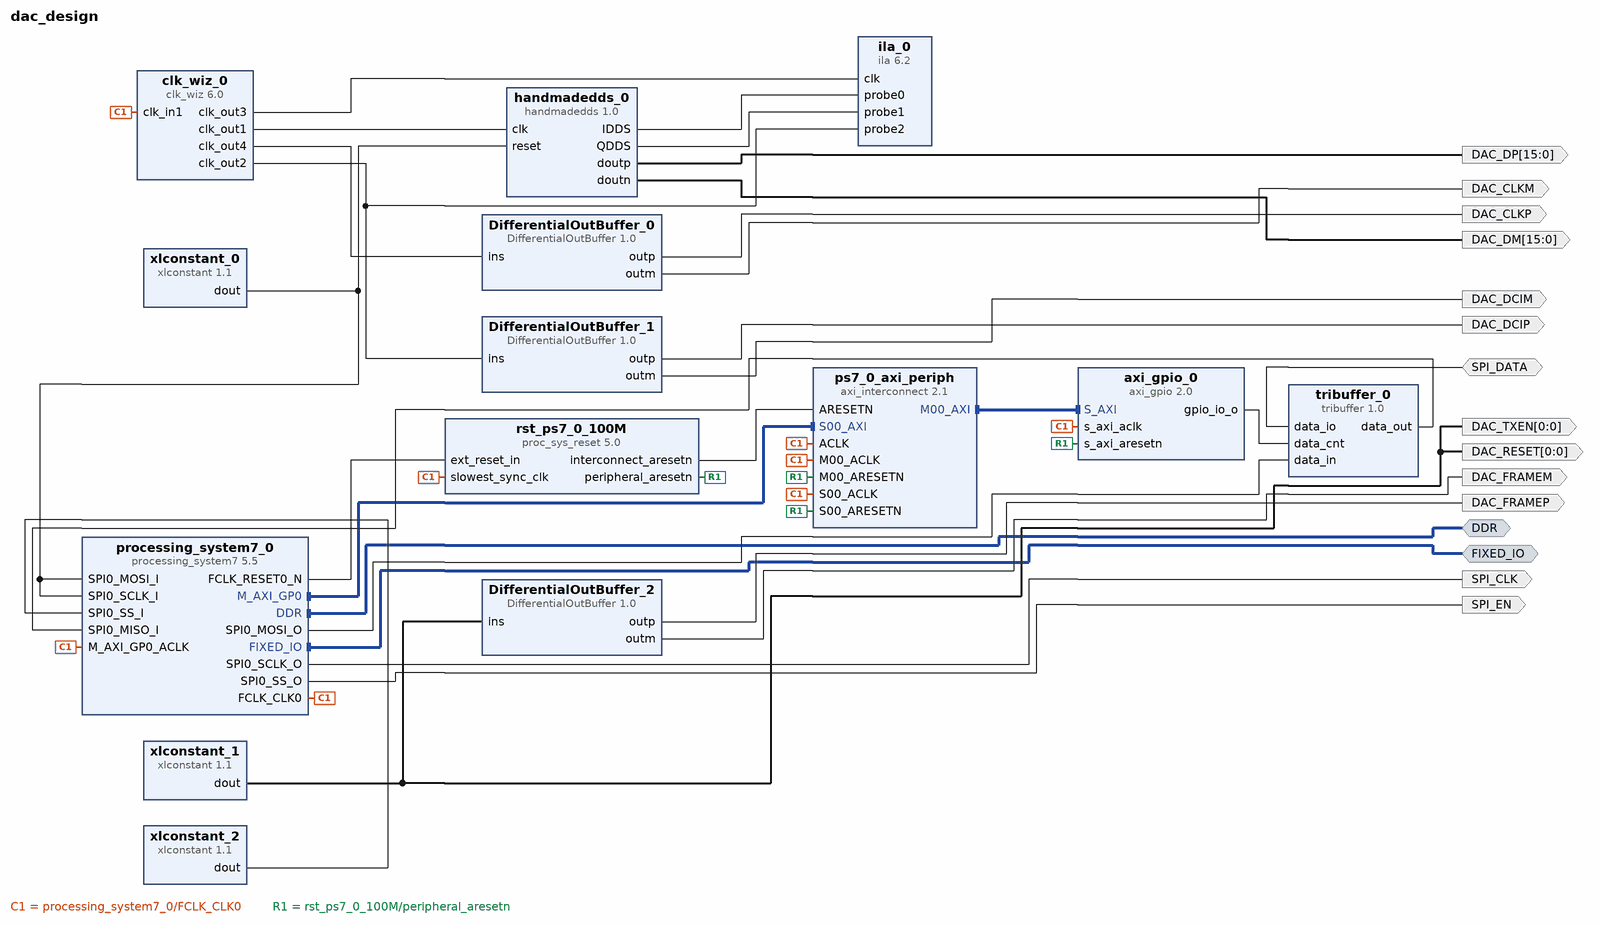
[diagram p0: block diagram of the top level]
# Vivado block design dac_design, xc7z020clg484-1, Vivado 2018.1
create_bd_design dac_design

create_bd_intf_port -mode Master -vlnv xilinx.com:interface:ddrx_rtl:1.0 DDR
create_bd_intf_port -mode Master -vlnv xilinx.com:display_processing_system7:fixedio_rtl:1.0 FIXED_IO
create_bd_port -dir O -type clk DAC_CLKP
create_bd_port -dir O -type clk DAC_CLKM
create_bd_port -dir O -type clk DAC_DCIP
create_bd_port -dir O -type clk DAC_DCIM
create_bd_port -dir O -from 15 -to 0 DAC_DP
create_bd_port -dir O -from 15 -to 0 DAC_DM
create_bd_port -dir O DAC_FRAMEP
create_bd_port -dir O DAC_FRAMEM
create_bd_port -dir O -type clk SPI_CLK
create_bd_port -dir O SPI_EN
create_bd_port -dir IO SPI_DATA
create_bd_port -dir O -from 0 -to 0 DAC_RESET
create_bd_port -dir O -from 0 -to 0 DAC_TXEN

create_bd_cell -type ip -vlnv xilinx.com:ip:processing_system7:5.5 processing_system7_0
set_property -dict [list \
  CONFIG.PCW_UIPARAM_DDR_FREQ_MHZ 533.333313 \
  CONFIG.PCW_APU_PERIPHERAL_FREQMHZ 666.666667 \
  CONFIG.PCW_UART_PERIPHERAL_FREQMHZ 50 \
  CONFIG.PCW_FPGA0_PERIPHERAL_FREQMHZ 100.000000 \
  CONFIG.PCW_FPGA1_PERIPHERAL_FREQMHZ 150.000000 \
  CONFIG.PCW_PRESET_BANK1_VOLTAGE {LVCMOS 2.5V} \
  CONFIG.PCW_UIPARAM_DDR_PARTNO {MT41J128M16 HA-15E} \
  CONFIG.PCW_QSPI_PERIPHERAL_ENABLE 1 \
  CONFIG.PCW_QSPI_QSPI_IO {MIO 1 .. 6} \
  CONFIG.PCW_QSPI_GRP_SINGLE_SS_ENABLE 1 \
  CONFIG.PCW_QSPI_GRP_SINGLE_SS_IO {MIO 1 .. 6} \
  CONFIG.PCW_SINGLE_QSPI_DATA_MODE x4 \
  CONFIG.PCW_ENET0_PERIPHERAL_ENABLE 1 \
  CONFIG.PCW_ENET0_ENET0_IO {MIO 16 .. 27} \
  CONFIG.PCW_ENET0_GRP_MDIO_ENABLE 1 \
  CONFIG.PCW_ENET0_GRP_MDIO_IO {MIO 52 .. 53} \
  CONFIG.PCW_SD0_PERIPHERAL_ENABLE 0 \
  CONFIG.PCW_UART1_PERIPHERAL_ENABLE 1 \
  CONFIG.PCW_UART1_UART1_IO {MIO 48 .. 49} \
  CONFIG.PCW_SPI0_PERIPHERAL_ENABLE 1 \
  CONFIG.PCW_SPI0_SPI0_IO EMIO \
  CONFIG.PCW_USB0_PERIPHERAL_ENABLE 0 \
  CONFIG.PCW_GPIO_MIO_GPIO_ENABLE 0 \
  CONFIG.preset ZedBoard \
] [get_bd_cells processing_system7_0]
# 135 more settings of processing_system7_0 are not shown: defaults, MIO pin electricals, DDR timing, and values the tool derives
create_bd_cell -type ip -vlnv xilinx.com:ip:clk_wiz:6.0 clk_wiz_0
set_property -dict [list \
  CONFIG.PRIMITIVE PLL \
  CONFIG.CLKOUT2_USED true \
  CONFIG.CLKOUT3_USED true \
  CONFIG.CLKOUT4_USED true \
  CONFIG.NUM_OUT_CLKS 4 \
  CONFIG.CLKOUT1_REQUESTED_OUT_FREQ 150.000 \
  CONFIG.CLKOUT2_REQUESTED_OUT_FREQ 150.000 \
  CONFIG.CLKOUT2_REQUESTED_PHASE 90.000 \
  CONFIG.CLKOUT3_REQUESTED_OUT_FREQ 75.000 \
  CONFIG.CLKOUT4_REQUESTED_OUT_FREQ 300.000 \
  CONFIG.PRIM_SOURCE Global_buffer \
  CONFIG.CLKOUT1_DRIVES BUFG \
  CONFIG.CLKOUT2_DRIVES BUFG \
  CONFIG.CLKOUT3_DRIVES BUFG \
  CONFIG.CLKOUT4_DRIVES BUFG \
  CONFIG.CLKOUT5_DRIVES BUFG \
  CONFIG.CLKOUT6_DRIVES BUFG \
  CONFIG.CLKOUT7_DRIVES BUFG \
  CONFIG.USE_LOCKED false \
  CONFIG.USE_RESET false \
  CONFIG.MMCM_DIVCLK_DIVIDE 1 \
  CONFIG.MMCM_CLKFBOUT_MULT_F 9 \
  CONFIG.MMCM_CLKIN1_PERIOD 10.000 \
  CONFIG.MMCM_CLKIN2_PERIOD 10.000 \
  CONFIG.MMCM_COMPENSATION ZHOLD \
  CONFIG.MMCM_CLKOUT0_DIVIDE_F 6 \
  CONFIG.MMCM_CLKOUT1_DIVIDE 6 \
  CONFIG.MMCM_CLKOUT1_PHASE 90.000 \
  CONFIG.MMCM_CLKOUT2_DIVIDE 12 \
  CONFIG.MMCM_CLKOUT3_DIVIDE 3 \
  CONFIG.USE_BOARD_FLOW true \
  CONFIG.CLK_IN1_BOARD_INTERFACE Custom \
  CONFIG.CLKOUT1_JITTER 127.220 \
  CONFIG.CLKOUT1_PHASE_ERROR 105.461 \
  CONFIG.CLKOUT2_JITTER 127.220 \
  CONFIG.CLKOUT2_PHASE_ERROR 105.461 \
  CONFIG.CLKOUT3_JITTER 146.170 \
  CONFIG.CLKOUT3_PHASE_ERROR 105.461 \
  CONFIG.CLKOUT4_JITTER 111.879 \
  CONFIG.CLKOUT4_PHASE_ERROR 105.461 \
] [get_bd_cells clk_wiz_0]
create_bd_cell -type ip -vlnv rs.local:user:DifferentialOutBuffer:1.0 DifferentialOutBuffer_0
create_bd_cell -type ip -vlnv rs.local:user:DifferentialOutBuffer:1.0 DifferentialOutBuffer_1
create_bd_cell -type ip -vlnv xilinx.com:ip:ila:6.2 ila_0
set_property -dict [list \
  CONFIG.C_PROBE1_WIDTH 16 \
  CONFIG.C_PROBE0_WIDTH 16 \
  CONFIG.C_NUM_OF_PROBES 3 \
  CONFIG.C_ENABLE_ILA_AXI_MON false \
  CONFIG.C_MONITOR_TYPE Native \
] [get_bd_cells ila_0]
create_bd_cell -type ip -vlnv xilinx.com:ip:xlconstant:1.1 xlconstant_0
set_property -dict {CONFIG.CONST_VAL 0} [get_bd_cells xlconstant_0]
create_bd_cell -type ip -vlnv rs.local:user:DifferentialOutBuffer:1.0 DifferentialOutBuffer_2
create_bd_cell -type ip -vlnv xilinx.com:ip:xlconstant:1.1 xlconstant_1
create_bd_cell -type ip -vlnv xilinx.com:ip:xlconstant:1.1 xlconstant_2
create_bd_cell -type ip -vlnv xilinx.com:ip:axi_gpio:2.0 axi_gpio_0
set_property -dict [list \
  CONFIG.C_GPIO_WIDTH 1 \
  CONFIG.C_ALL_INPUTS 0 \
  CONFIG.USE_BOARD_FLOW true \
  CONFIG.GPIO_BOARD_INTERFACE Custom \
  CONFIG.C_ALL_OUTPUTS 1 \
] [get_bd_cells axi_gpio_0]
create_bd_cell -type ip -vlnv xilinx.com:ip:axi_interconnect:2.1 ps7_0_axi_periph
set_property -dict {CONFIG.NUM_MI 1} [get_bd_cells ps7_0_axi_periph]
create_bd_cell -type ip -vlnv xilinx.com:ip:proc_sys_reset:5.0 rst_ps7_0_100M
create_bd_cell -type ip -vlnv rs.local:user:tribuffer:1.0 tribuffer_0
create_bd_cell -type ip -vlnv rs.local:user:handmadedds:1.0 handmadedds_0

# ---- connections ----

connect_bd_intf_net [get_bd_intf_pins processing_system7_0/M_AXI_GP0] [get_bd_intf_pins ps7_0_axi_periph/S00_AXI]
connect_bd_intf_net [get_bd_intf_pins ps7_0_axi_periph/M00_AXI] [get_bd_intf_pins axi_gpio_0/S_AXI]
connect_bd_intf_net [get_bd_intf_ports DDR] [get_bd_intf_pins processing_system7_0/DDR]
connect_bd_intf_net [get_bd_intf_ports FIXED_IO] [get_bd_intf_pins processing_system7_0/FIXED_IO]
connect_bd_net [get_bd_pins processing_system7_0/FCLK_CLK0] \
  [get_bd_pins processing_system7_0/M_AXI_GP0_ACLK] [get_bd_pins clk_wiz_0/clk_in1] \
  [get_bd_pins rst_ps7_0_100M/slowest_sync_clk] [get_bd_pins axi_gpio_0/s_axi_aclk] [get_bd_pins ps7_0_axi_periph/S00_ACLK] \
  [get_bd_pins ps7_0_axi_periph/M00_ACLK] [get_bd_pins ps7_0_axi_periph/ACLK]
connect_bd_net [get_bd_pins handmadedds_0/IDDS] [get_bd_pins ila_0/probe0]
connect_bd_net [get_bd_pins handmadedds_0/QDDS] [get_bd_pins ila_0/probe1]
connect_bd_net [get_bd_pins DifferentialOutBuffer_0/outp] [get_bd_ports DAC_CLKP]
connect_bd_net [get_bd_pins DifferentialOutBuffer_0/outm] [get_bd_ports DAC_CLKM]
connect_bd_net [get_bd_pins DifferentialOutBuffer_1/outp] [get_bd_ports DAC_DCIP]
connect_bd_net [get_bd_pins DifferentialOutBuffer_1/outm] [get_bd_ports DAC_DCIM]
connect_bd_net [get_bd_pins handmadedds_0/doutp] [get_bd_ports DAC_DP]
connect_bd_net [get_bd_pins handmadedds_0/doutn] [get_bd_ports DAC_DM]
connect_bd_net [get_bd_pins DifferentialOutBuffer_2/outp] [get_bd_ports DAC_FRAMEP]
connect_bd_net [get_bd_pins DifferentialOutBuffer_2/outm] [get_bd_ports DAC_FRAMEM]
connect_bd_net [get_bd_pins processing_system7_0/SPI0_SCLK_O] [get_bd_ports SPI_CLK]
connect_bd_net [get_bd_pins processing_system7_0/SPI0_SS_O] [get_bd_ports SPI_EN]
connect_bd_net [get_bd_pins xlconstant_2/dout] [get_bd_pins processing_system7_0/SPI0_SS_I]
connect_bd_net [get_bd_pins clk_wiz_0/clk_out3] [get_bd_pins ila_0/clk]
connect_bd_net [get_bd_pins processing_system7_0/FCLK_RESET0_N] [get_bd_pins rst_ps7_0_100M/ext_reset_in]
connect_bd_net [get_bd_pins rst_ps7_0_100M/peripheral_aresetn] \
  [get_bd_pins axi_gpio_0/s_axi_aresetn] [get_bd_pins ps7_0_axi_periph/S00_ARESETN] \
  [get_bd_pins ps7_0_axi_periph/M00_ARESETN]
connect_bd_net [get_bd_pins rst_ps7_0_100M/interconnect_aresetn] [get_bd_pins ps7_0_axi_periph/ARESETN]
connect_bd_net [get_bd_pins axi_gpio_0/gpio_io_o] [get_bd_pins tribuffer_0/data_cnt]
connect_bd_net [get_bd_pins tribuffer_0/data_out] [get_bd_pins processing_system7_0/SPI0_MISO_I]
connect_bd_net [get_bd_pins processing_system7_0/SPI0_MOSI_O] [get_bd_pins tribuffer_0/data_in]
connect_bd_net [get_bd_ports SPI_DATA] [get_bd_pins tribuffer_0/data_io]
connect_bd_net [get_bd_pins xlconstant_1/dout] [get_bd_ports DAC_TXEN] [get_bd_ports DAC_RESET] [get_bd_pins DifferentialOutBuffer_2/ins]
connect_bd_net [get_bd_pins xlconstant_0/dout] \
  [get_bd_pins processing_system7_0/SPI0_SCLK_I] [get_bd_pins processing_system7_0/SPI0_MOSI_I] \
  [get_bd_pins handmadedds_0/reset]
connect_bd_net [get_bd_pins clk_wiz_0/clk_out2] [get_bd_pins ila_0/probe2] [get_bd_pins DifferentialOutBuffer_1/ins]
connect_bd_net [get_bd_pins clk_wiz_0/clk_out4] [get_bd_pins DifferentialOutBuffer_0/ins]
connect_bd_net [get_bd_pins clk_wiz_0/clk_out1] [get_bd_pins handmadedds_0/clk]

# ---- address map ----
assign_bd_address -offset 0x41200000 -range 64K -target_address_space [get_bd_addr_spaces processing_system7_0/Data] [get_bd_addr_segs axi_gpio_0/S_AXI/Reg]

validate_bd_design
save_bd_design
